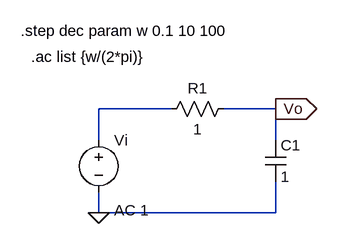
[diagram p0: schematic passive-filter-low-pass-omega.asc]
passive-filter-low-pass-omega.asc, the LTspice schematic file:
Version 4
SHEET 1 880 680
WIRE 160 96 48 96
WIRE 320 96 240 96
WIRE 48 144 48 96
WIRE 320 144 320 96
WIRE 48 256 48 224
WIRE 320 256 320 208
WIRE 320 256 48 256
FLAG 48 256 0
FLAG 320 96 Vo
IOPIN 320 96 Out
SYMBOL voltage 48 128 R0
WINDOW 123 24 124 Left 2
WINDOW 39 0 0 Left 2
SYMATTR Value2 AC 1
SYMATTR InstName Vi
SYMATTR Value ""
SYMBOL res 144 112 R270
WINDOW 0 32 56 VTop 2
WINDOW 3 0 56 VBottom 2
SYMATTR InstName R1
SYMATTR Value 1
SYMBOL cap 304 144 R0
SYMATTR InstName C1
SYMATTR Value 1
TEXT -72 -24 Left 2 !.step dec param w 0.1 10 100
TEXT -56 16 Left 2 !.ac list {w/(2*pi)}

The netlist it stands for:
* passive-filter-low-pass-omega.asc
Vi N001 0 AC 1
R1 N001 Vo 1
C1 Vo 0 1
.step dec param w 0.1 10 100
.ac list {w/(2*pi)}
.backanno
.end